# EAGLE schematic Server wire chart (EAGLE 9.6.2)
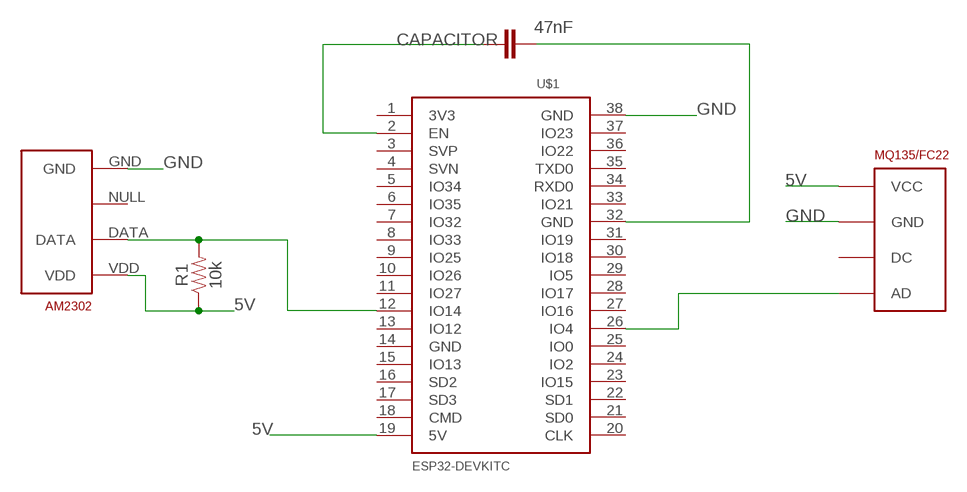
[diagram p0: schematic, sheet 1]

## Parts
AM2302  RHT03_DHT-22_AM2302  [RHT03_DHT-22]
CAPACITOR  47nF  C2,5-3  [C2.5-3]
MQ135/FC22  MQ  [RHT03_DHT-22]
R1  10k  10KOHM-0402-1/16W-1%  [0402]
U$1  ESP32DEVKITC  [ESP32-DEVKITC]

## Nets
5V: AM2302.VDD MQ135/FC22.VDD(VCC) R1.1 U$1.19(5V)
GND: AM2302.GND MQ135/FC22.DATA(GND) U$1.38(GND)
N$1: MQ135/FC22.GND(AD) U$1.26(IO4)
N$2: AM2302.DATA R1.2 U$1.12(IO14)
N$3: CAPACITOR.1 U$1.2(EN)
N$4: CAPACITOR.2 U$1.32(GND)
Unconnected: AM2302.NULL U$1.1(3V3) U$1.3(SVP) U$1.4(SVN) U$1.5(IO34) U$1.6(IO35) U$1.7(IO32) U$1.8(IO33) U$1.9(IO25) U$1.10(IO26) U$1.11(IO27) U$1.13(IO12) U$1.14(GND) U$1.15(IO13) U$1.16(SD2) U$1.17(SD3) U$1.18(CMD) U$1.20(CLK) U$1.21(SD0) U$1.22(SD1) U$1.23(IO15) U$1.24(IO2) U$1.25(IO0) U$1.27(IO16) U$1.28(IO17) U$1.29(IO5) U$1.30(IO18) U$1.31(IO19) U$1.33(IO21) U$1.34(RXD0) U$1.35(TXD0) U$1.36(IO22) U$1.37(IO23)

## Power pins joined to a net without a drawn wire
DC: MQ135/FC22.NULL(DC)

## Library data of the parts
AM2302 = RHT03_DHT-22_AM2302:RHT03_DHT-22_AM2302: RHT03 / DHT-22 / AM2302 Packages and symbol for the RHT03 / DHT-22 relative humidity and temperature sensor. Note: The AM2302 is a wired version of the DHT-22 which typically requires less clearance and is thus provided as a separate package.; PROD_ID: SEN-10167
CAPACITOR = capacitor-wima:C: CAPACITOR naming: grid - package width
MQ135/FC22 = RHT03_DHT-22_AM2302:MQ: RHT03 / DHT-22 / AM2302 Packages and symbol for the RHT03 / DHT-22 relative humidity and temperature sensor. Note: The AM2302 is a wired version of the DHT-22 which typically requires less clearance and is thus provided as a separate package.; PROD_ID: SEN-10167
R1 = SparkFun-Resistors:10KOHM: 10kΩ resistor A resistor is a passive two-terminal electrical component that implements electrical resistance as a circuit element. Resistors act to reduce current flow, and, at the same time, act to lower voltage levels within circuits. - Wikipedia; PROD_ID: RES-14241
U$1 = ESP32-DEVKITC:ESP32DEVKITC